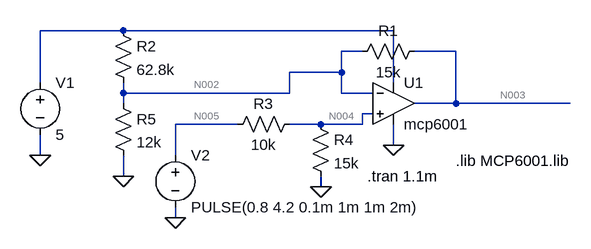
[diagram p0: schematic throttle-fix.asc]
throttle-fix.asc, the LTspice schematic file:
Version 4
SHEET 1 2152 680
WIRE 160 16 32 16
WIRE 576 16 160 16
WIRE 528 48 496 48
WIRE 672 48 608 48
WIRE 496 80 496 48
WIRE 496 80 416 80
WIRE 32 96 32 16
WIRE 576 96 576 16
WIRE 160 112 160 96
WIRE 416 112 416 80
WIRE 416 112 160 112
WIRE 496 112 496 80
WIRE 544 112 496 112
WIRE 160 128 160 112
WIRE 672 128 672 48
WIRE 672 128 608 128
WIRE 848 128 672 128
WIRE 544 144 528 144
WIRE 336 160 240 160
WIRE 464 160 416 160
WIRE 528 160 528 144
WIRE 528 160 464 160
WIRE 576 192 576 160
WIRE 32 208 32 176
WIRE 240 208 240 160
WIRE 160 240 160 208
WIRE 464 256 464 240
WIRE 240 304 240 288
FLAG 576 192 0
FLAG 32 208 0
FLAG 240 304 0
FLAG 464 256 0
FLAG 160 240 0
SYMBOL Opamps\\opamp2 576 64 R0
SYMATTR InstName U1
SYMATTR Value mcp6001
SYMBOL voltage 32 80 R0
WINDOW 123 0 0 Left 0
WINDOW 39 0 0 Left 0
SYMATTR InstName V1
SYMATTR Value 5
SYMBOL voltage 240 192 R0
WINDOW 123 0 0 Left 0
WINDOW 39 0 0 Left 0
SYMATTR InstName V2
SYMATTR Value PULSE(0.8 4.2 0.1m 1m 1m 2m)
SYMBOL res 624 32 R90
WINDOW 0 0 56 VBottom 2
WINDOW 3 32 56 VTop 2
SYMATTR InstName R1
SYMATTR Value 15k
SYMBOL res 432 144 R90
WINDOW 0 0 56 VBottom 2
WINDOW 3 32 56 VTop 2
SYMATTR InstName R3
SYMATTR Value 10k
SYMBOL res 448 144 R0
SYMATTR InstName R4
SYMATTR Value 15k
SYMBOL res 144 0 R0
SYMATTR InstName R2
SYMATTR Value 62.8k
SYMBOL res 144 112 R0
SYMATTR InstName R5
SYMATTR Value 12k
TEXT 672 216 Left 2 !.lib MCP6001.lib
TEXT 536 240 Left 2 !.tran 1.1m

The netlist it stands for:
* throttle-fix.asc
XU1 N004 N002 N001 0 N003 mcp6001  ; pins In+ In- V+ V- OUT
V1 N001 0 5
V2 N005 0 PULSE(0.8 4.2 0.1m 1m 1m 2m)
R1 N003 N002 15k
R3 N004 N005 10k
R4 N004 0 15k
R2 N001 N002 62.8k
R5 N002 0 12k
.lib MCP6001.lib
.tran 1.1m
.backanno
.end

* Results of the author's LTspice run, read from the files saved beside the schematic
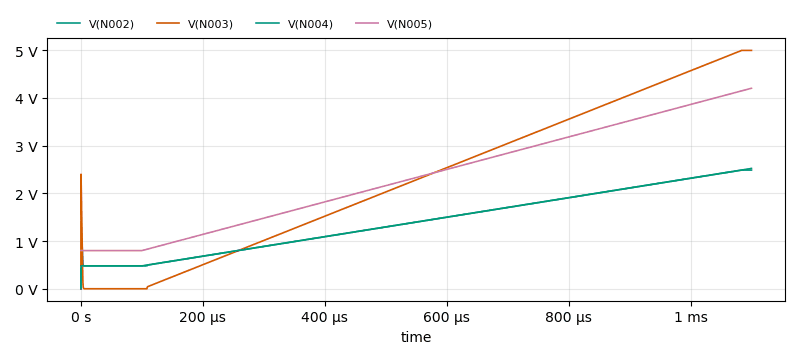
[diagram p1: Transient Analysis of throttle-fix.asc, plotted from the saved traces]
* Transient Analysis, 1 run:
*   V(N002): min 526.9 nV, max 2.486 V, average 1.407 V, rms 1.584 V, last 2.486 V
*   V(N003): min 66.95 µV, max 4.994 V, average 2.308 V, rms 2.932 V, last 4.994 V
*   V(N004): min 529.5 nV, max 2.52 V, average 1.407 V, rms 1.584 V, last 2.52 V
*   V(N005): min 800 mV, max 4.2 V, average 2.345 V, rms 2.641 V, last 4.2 V